# EAGLE design alim (EAGLE 5.11)
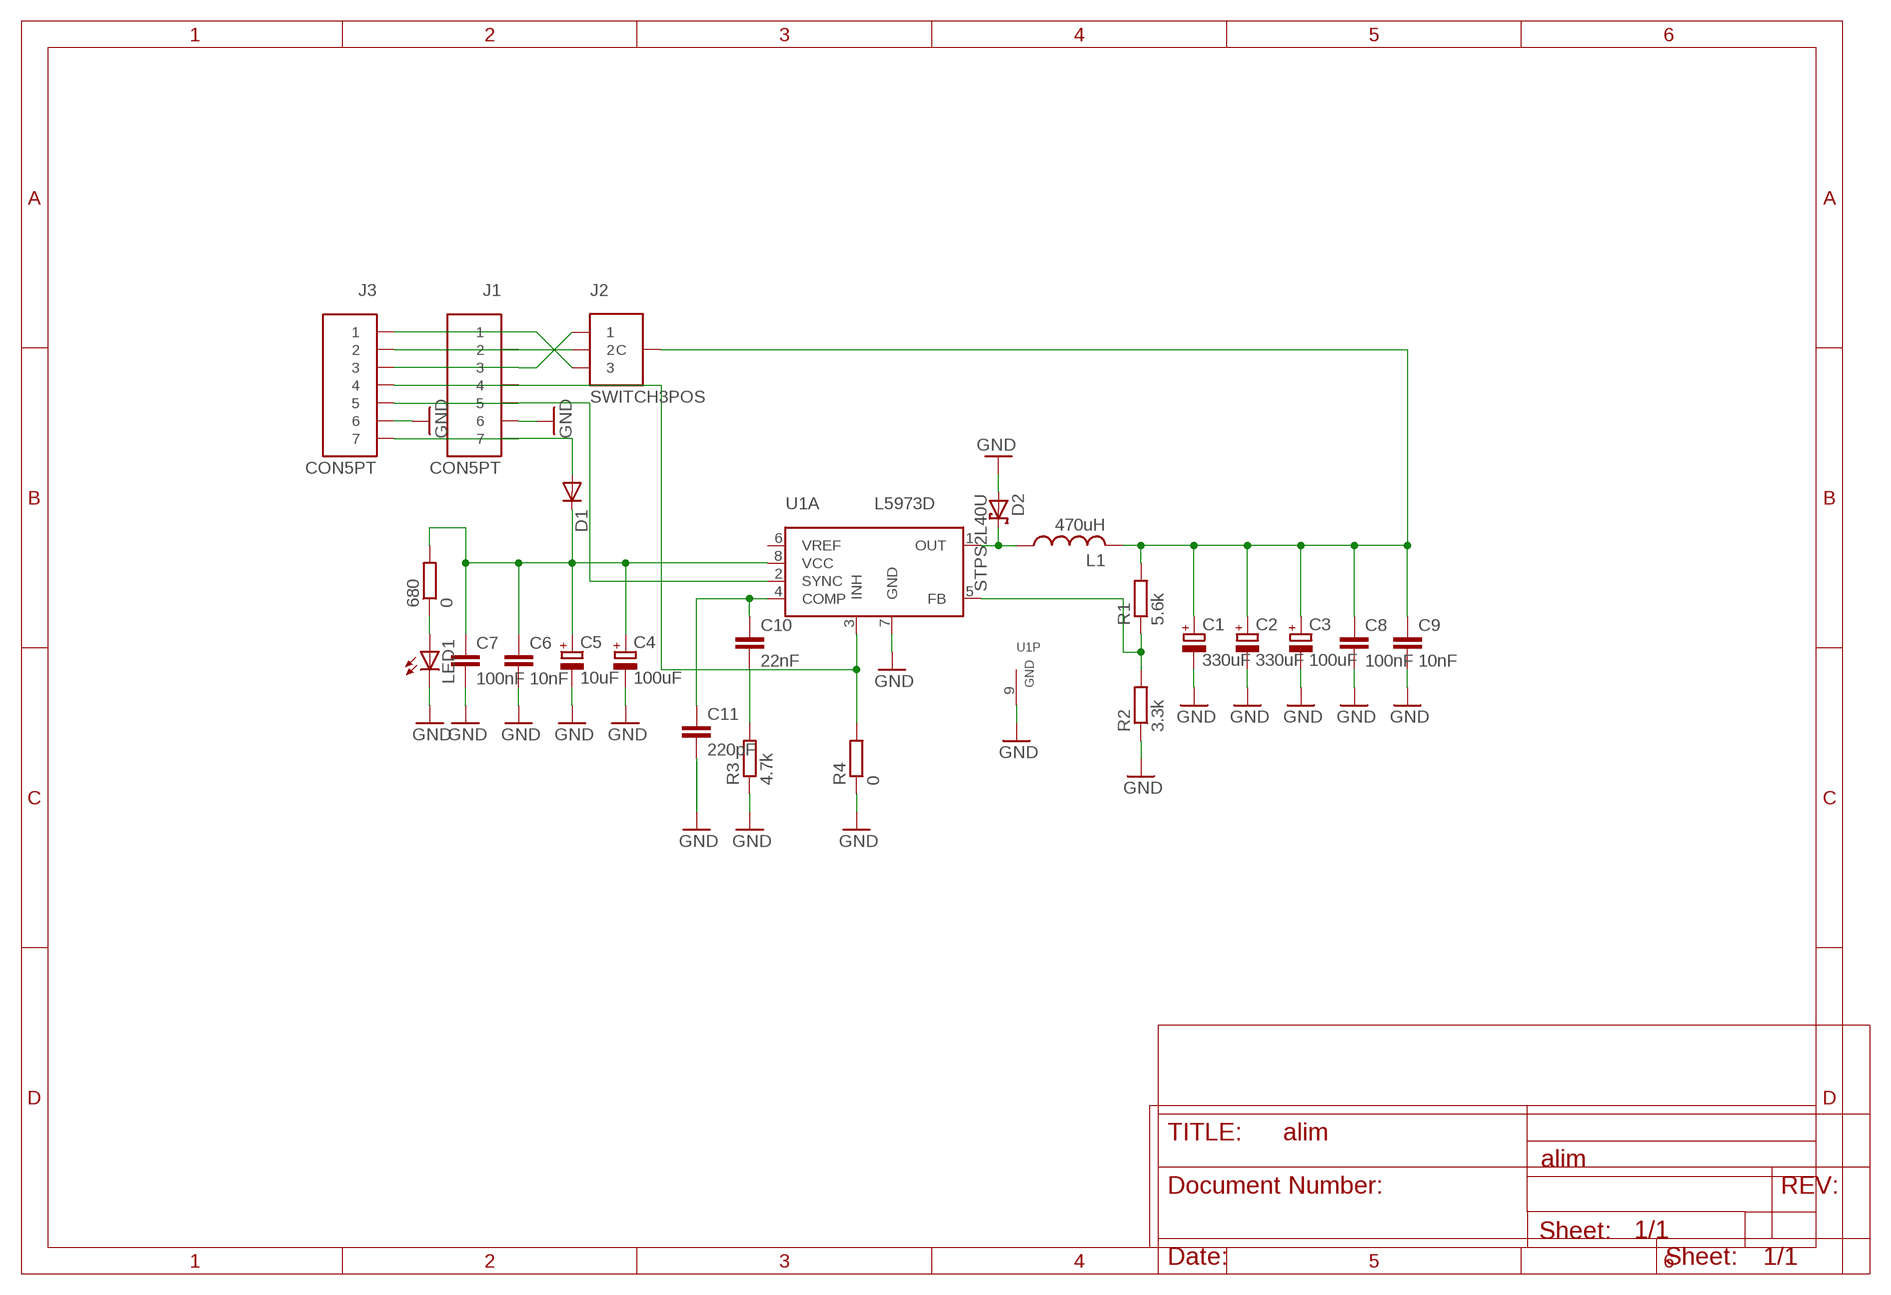
[diagram p0: schematic, sheet 1]

## Parts
680  0  R-EU_R0805  [R0805]
C1  330uF  CPOL-EU140CLH-0810  [140CLH-0810]
C2  330uF  CPOL-EU140CLH-0810  [140CLH-0810]
C3  100uF  CPOL-EU140CLH-0810  [140CLH-0810]
C4  100uF  CPOL-EU140CLH-0810  [140CLH-0810]
C5  10uF  CPOL-EU140CLH-0810  [140CLH-0810]
C6  10nF  C-EUC0805K  [C0805K]
C7  100nF  C-EUC0805K  [C0805K]
C8  100nF  C-EUC0805K  [C0805K]
C9  10nF  C-EUC0805K  [C0805K]
C10  22nF  C-EUC0805K  [C0805K]
C11  220pF  C-EUC0805K  [C0805K]
D1  DIODE-DO-214AC  [DO-214AC]
D2  STPS2L40U  [DO-214AA]
J1  CON5PT  [CON5PT]
J2  SWITCH3POS  [SWITCH3POS]
J3  CON5PT  [CON5PT]
L1  470uH  B82477P4  [BOBINE]
LED1  LEDCHIPLED_0805  [CHIPLED_0805]
R1  5.6k  R-EU_R0805  [R0805]
R2  3.3k  R-EU_R0805  [R0805]
R3  4.7k  R-EU_R0805  [R0805]
R4  0  R-EU_R0805  [R0805]
U1  L5973D  [HSOP8]

## Nets
GND: C1.- C2.- C3.- C4.- C5.- C6.2 C7.2 C8.2 C9.2 C11.2 D2.A J1.6 J3.6 LED1.C R2.1 R3.1 R4.1 U1.7(A:GND) U1.9(P:GND)
N$1: C1.+ C2.+ C3.+ C8.1 C9.1 J2.C L1.P$2 R1.2
N$2: R1.1 R2.2 U1.5(A:FB)
N$3: D1.A J1.7 J3.7
N$4: J1.1 J2.3 J3.1
N$5: J1.4 J3.4 R4.2 U1.3(A:INH)
N$6: C10.2 R3.2
N$7: C10.1 C11.1 U1.4(A:COMP)
N$8: J1.2 J2.2 J3.2
N$9: J1.3 J2.1 J3.3
N$10: J1.5 J3.5 U1.2(A:SYNC)
N$11: 680.1 LED1.A
OUT: D2.C L1.P$1 U1.1(A:OUT)
VCC: 680.2 C4.+ C5.+ C6.1 C7.1 D1.C U1.8(A:VCC)
Unconnected: U1.6(A:VREF)

## Library data of the parts
680 R1-R4 = resistor:R-EU_: RESISTOR, European symbol
C1-C5 = resistor:CPOL-EU: POLARIZED CAPACITOR, European symbol
C6-C11 = resistor:C-EU: CAPACITOR, European symbol
D1 = diode:DIODE-: DIODE
D2 = intech:STPS2L40U: Référence farnell: 1373662
J1 J3 = libINTech:CON5PT
J2 = libINTech:SWITCH3POS
L1 = intech:B82477P4: Reference farnell: 1644655
LED1 = led:LED: LED OSRAM: - CHIPLED LG R971, LG N971, LY N971, LG Q971, LY Q971, LO R971, LY R971 LH N974, LH R974 LS Q976, LO Q976, LY Q976 LO Q996 - Hyper CHIPLED LW Q18S LB Q993, LB Q99A, LB R99A - SideLED LS A670, LO A670, LY A670, LG A670, LP A670 LB A673, LV A673, LT A673, LW A673 LH A674 LY A675 LS A676, LA A676, LO A676, LY A676, LW A676 LS A679, LY A679, LG A679 - Hyper Micro SIDELED® LS Y876, LA Y876, LO Y876, LY Y876 LT Y87S - SmartLED LW L88C, LW L88S LB L89C, LB L89S, LG L890 LS L89K, LO L89K, LY L89K LS L896, LA L896, LO L896, LY L896 - TOPLED LS T670, LO T670, LY T670, LG T670, LP T670 LSG T670, LSP T670, LSY T670, LOP T670, LYG T670 LG T671, LOG T671, LSG T671 LB T673, LV T673, LT T673, LW T673 LH T674 LS T676, LA T676, LO T676, LY T676, LB T676, LH T676, LSB T676, LW T676 LB T67C, LV T67C, LT T67C, LS T67K, LO T67K, LY T67K, LW E67C LS E67B, LA E67B, LO E67B, LY E67B, LB E67C, LV E67C, LT E67C LW T67C LS T679, LY T679, LG T679 LS T770, LO T770, LY T770, LG T770, LP T770 LB T773, LV T773, LT T773, LW T773 LH T774 LS E675, LA E675, LY E675, LS T675 LS T776, LA T776, LO T776, LY T776, LB T776 LHGB T686 LT T68C, LB T68C - Hyper Mini TOPLED® LB M676 - Mini TOPLED Santana® LG M470 LS M47K, LO M47K, LY M47K Source: http://www.osram.convergy.de LUXEON: - LUMILED® LXK2-PW12-R00, LXK2-PW12-S00, LXK2-PW14-U00, LXK2-PW14-V00 LXK2-PM12-R00, LXK2-PM12-S00, LXK2-PM14-U00 LXK2-PE12-Q00, LXK2-PE12-R00, LXK2-PE12-S00, LXK2-PE14-T00, LXK2-PE14-U00 LXK2-PB12-K00, LXK2-PB12-L00, LXK2-PB12-M00, LXK2-PB14-N00, LXK2-PB14-P00, LXK2-PB14-Q00 LXK2-PR12-L00, LXK2-PR12-M00, LXK2-PR14-Q00, LXK2-PR14-R00 LXK2-PD12-Q00, LXK2-PD12-R00, LXK2-PD12-S00 LXK2-PH12-R00, LXK2-PH12-S00 LXK2-PL12-P00, LXK2-PL12-Q00, LXK2-PL12-R00 Source: www.luxeon.com KINGBRIGHT: KA-3528ASYC Source: www.kingbright.com
U1 = l5973d:L5973D: 2.5A switch step down switching regulator

## Board
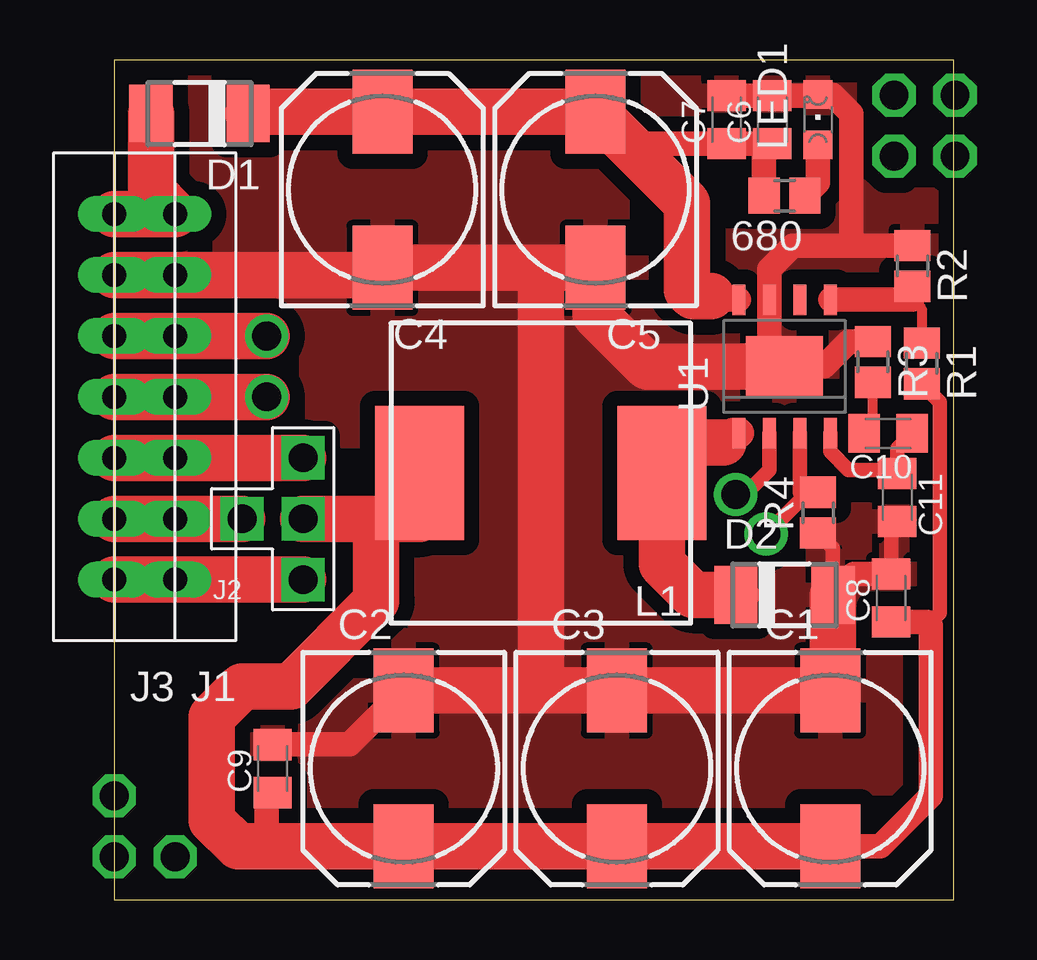
[diagram p1: board, top side]
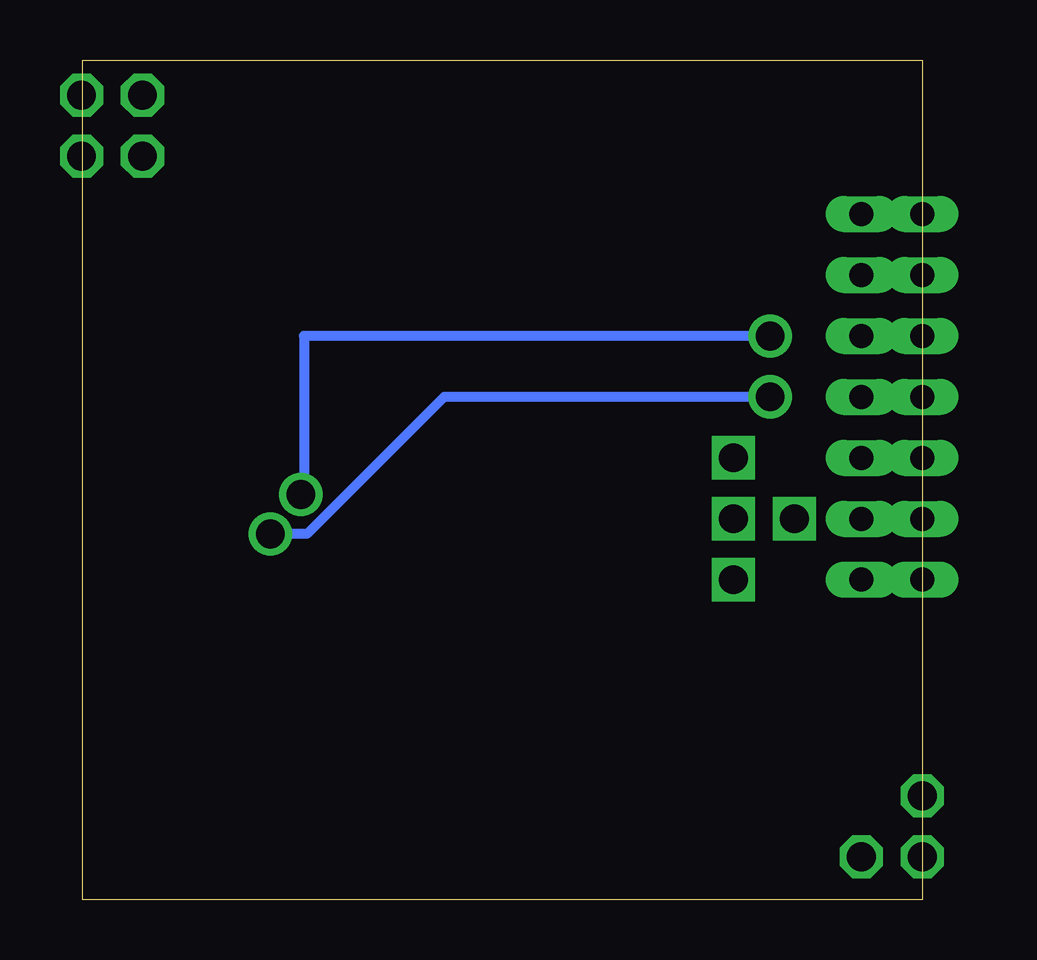
[diagram p2: board, bottom side, seen from below]

Size 35 x 35 mm. Coordinates in mm from the lower left corner, seen from the top.
Outline: 0,0 35,0 35,35 0,35 0,0
Copper layers (1*16): Top 0.035mm / dielectric 1.5mm / Bottom 0.035mm
Design rules "default *": minimum track width 10mil, minimum drill 24mil, track to track 0.2mm, track to pad 0.2mm, pad to pad 0.2mm, via to via 0.2mm, smd to smd 0.1mm, copper to edge 0.2mm, drill to drill 0.4mm, minimum pad ring 10mil, minimum via ring 8mil, stop-mask expansion 4mil, vias tented up to drill 0mil, thermal gap 10mil

### Footprints (pad centres in the part's own frame; a part is rotated, then mirrored left to right if it is on the bottom)
R0805 = smd 1.3 x 1.5: 1 -0.85,0; 2 0.85,0
140CLH-0810 = smd 3.5 x 2.5: + 3.25,0; - -3.25,0
C0805K = smd 1.3 x 1.6: 1 -1,0; 2 1,0
DO-214AC = smd 1.8 x 2.4: A 2.025,0; C -2.025,0
DO-214AA = smd 1.8 x 2.4: A 2.025,0; C -2.025,0
CON5PT = drill 1 long: 1 -7.62,0; 2 -5.08,0; 3 -2.54,0; 4 0,0; 5 2.54,0; 6 5.08,0; 7 7.62,0
SWITCH3POS = drill 1.2 square: 1 0,2.54; 2 -2.54,0; 3 0,-2.54; C 0,0
BOBINE = smd 3.7 x 5.6: P$1 -5.05,0; P$2 5.05,0
CHIPLED_0805 = smd 1.2 x 1.2: A 0,-1.05; C 0,1.05
HSOP8 = smd 0.54 x 1.27: 1 -1.905,-2.785; 2 -0.635,-2.785; 3 0.635,-2.785; 4 1.905,-2.785; 5 1.905,2.785; 6 0.635,2.785; 7 -0.635,2.785; 8 -1.905,2.785 | smd 3.2 x 2.51: 9 0,0

### Placement (x,y rotation side)
680  27.94,29.34 180 top
C1  29.84,5.46 270 top
C2  12.06,5.46 270 top
C3  20.95,5.46 270 top
C4  11.18,29.59 90 top
C5  20.07,29.59 90 top
C6  27.43,32.51 90 top
C7  25.53,32.51 90 top
C8  32.38,12.57 90 top
C9  6.6,5.46 90 top
C10  32.26,19.43 180 top
C11  32.64,16.76 270 top
D1  3.56,32.77 180 top
D2  27.94,12.7 0 top
J1  2.54,20.95 90 top
J2  7.87,15.88 0 top
J3  0,20.95 90 top
L1  17.78,17.78 180 top
LED1  29.34,32.51 0 top
R1  33.66,22.35 270 top
R2  33.27,26.42 270 top
R3  31.62,22.42 270 top
R4  29.34,16.13 90 top
U1  27.94,22.23 0 top

### Tracks (layer width: path | path; a pad name or v marks a point on that pad's centre or on a via)
GND
  Top 0.406: 32.38,15.51 C11.2
  Top 0.61: C8.2 32.38,15.51 | R4.1 29.96,14.65 D2.A
  Top 1.016: C7.2 C6.2 29.29,33.51 LED1.C 29.94,33.56 30.73,32.77 30.73,27.27 | 30.73,27.27 28.28,27.27 27.3,26.29 U1.7 27.3,22.86 U1.9 29.59,22.23 30.63,23.27 R3.1 | 30.73,27.27 R2.1 | C9.2 9.81,6.46 C2.- | C8.2 30.84,13.57 D2.A
  Top 1.93: J3.6 J1.6 10.87,26.04 C4.- 17.78,26.34 | 17.78,26.34 C5.- 20.07,24.38 22.23,22.23 U1.9 | C2.- 17.78,8.71 | 17.78,8.71 C3.- C1.- 29.96,8.83 D2.A | 17.78,8.71 17.78,26.34
  pour Top (isolate 0.635): 0,0 35,0 35,35 0,35
N$1
  Top 0.61: R1.2 34.42,20.74 34.42,11.94 33.97,11.49
  Top 1.016: C1.+ 31.93,2.21 34.04,4.32 34.04,11.43 33.97,11.49 33.89,11.57 C8.1 | C9.1 6.35,4.21 6.35,2.21
  Top 1.93: 10.92,15.88 J2.C | L1.P$2 12.73,15.88 10.92,15.88 | 10.92,15.88 10.92,12.45 7.37,8.89 5.33,8.89 4.06,7.62 4.06,3.3 5.16,2.21 6.35,2.21 C2.+ C3.+ C1.+
N$2
  Top 0.406: 33.27,25.01 33.66,24.63 R1.1
  Top 1.016: U1.5 33.27,25.01 R2.2
N$3
  Top 1.93: J3.7 J1.7 1.53,29.58 D1.A
N$4
  Top 1.93: J3.1 J1.1 J2.3
N$5  (via drill 1.2 pad 1.02)
  Top 0.406: R4.2 28.57,16.98 28.57,16.64
  Top 0.61: 28.57,16.98 U1.3 | v27.18,15.24 28.57,16.64
  Top 1.93: J3.4 J1.4 v6.35,20.95
  Bottom 0.406: v6.35,20.95 19.94,20.95 25.65,15.24 v27.18,15.24
N$6
  Top 0.406: R3.2 31.62,19.8 C10.2
N$7
  Top 0.61: U1.4 29.84,18.67 30.61,17.91 32.5,17.91 C11.1 32.64,18.81 C10.1
N$8
  Top 1.93: J3.2 J1.2 J2.2
N$9
  Top 1.93: J2.1 J1.3 J3.3
N$10  (via drill 1.2 pad 1.02)
  Top 0.61: v25.91,16.89 26.29,16.89 27.3,17.91 U1.2
  Top 1.93: J3.5 J1.5 v6.35,23.5
  Bottom 0.406: v6.35,23.5 25.78,23.5 25.78,17.27 25.78,16.89 v25.91,16.89
N$11
  Top 1.016: LED1.A 29.34,29.88 680.1
N$12  (via drill 1.2 pad 1.02)
  other vias: 0,1.78
N$13  (via drill 1.2 pad 1.02)
  other vias: 2.54,1.78
N$15  (via drill 1.2 pad 1.02)
  other vias: 0,4.32
N$16  (via drill 1.2 pad 1.02)
  other vias: 32.51,30.99
N$17  (via drill 1.2 pad 1.02)
  other vias: 35.05,30.99
N$18  (via drill 1.2 pad 1.02)
  other vias: 35.05,33.53
N$19  (via drill 1.2 pad 1.02)
  other vias: 32.51,33.53
OUT
  Top 1.27: U1.1 25.79,19.44 25.4,19.05
  Top 1.93: D2.C 24.13,12.7 22.83,14 L1.P$1 24.1,19.05 25.4,19.05
VCC
  Top 1.016: 24.89,25.15 25.03,25.01 U1.8 | 26.92,31.51 C7.1 21.39,31.51 21.25,31.66 | 26.92,31.51 C6.1 | 680.2 27.09,31.35 26.92,31.51
  Top 1.93: D1.C 5.66,32.84 C4.+ C5.+ 21.25,31.66 23.88,29.03 23.88,25.4 24.13,25.15 24.89,25.15